# Altium schematic sheet Sche_Voltage regulator.SchDoc
size A
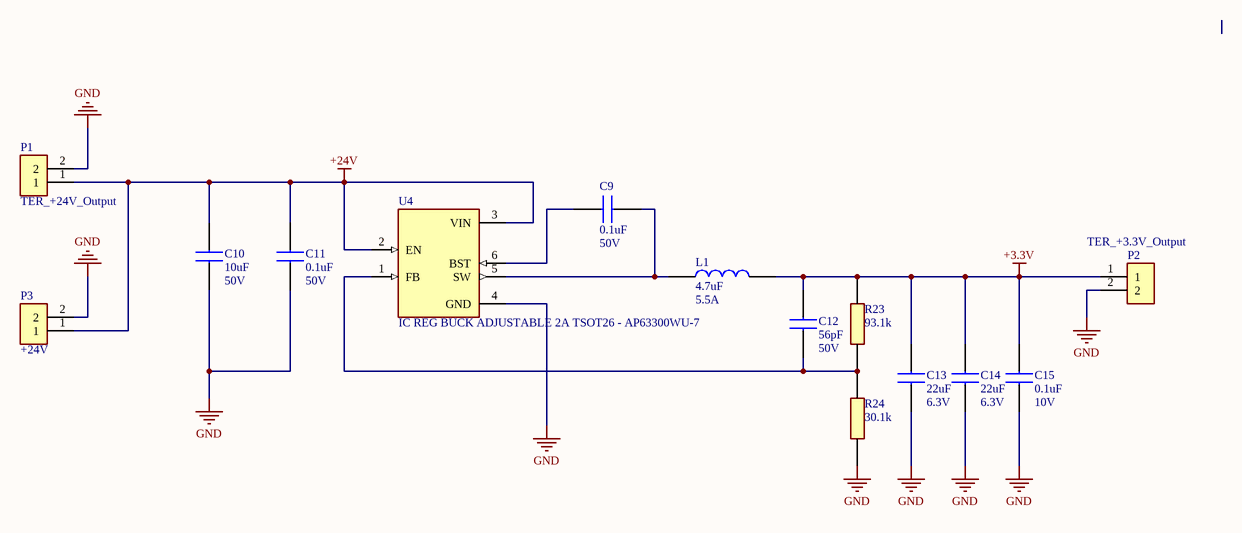
[diagram p0: Sche_Voltage regulator.SchDoc]

## Parts
C9  0.1uF  [C 0603]
C10  10uF  [CAPC3225X290N]
C11  0.1uF  [C 0603]
C12  56pF  [CAPC1005X55N]
C13  22uF  [C 0603]
C14  22uF  [C 0603]
C15  0.1uF  [CAPC1608X95N]
L1  4.7uF  [INDM6965X300N]
P1  Comment_1: TER_+24V_Output  [TE_282837-2]  (hidden comment: TERM BLK 2P SIDE ENT 5.08MM PCB - 282837-2)
P2  Comment_1: TER_+3.3V_Output  [TE_282837-2]  (hidden comment: 282837-2)
P3  Comment_1: +24V  [TE_282837-2]  (hidden comment: 282837-2)
R23  93.1k  [RESC1005X40N]
R24  30.1k  [ERJ2RKD1004X]
U4  IC REG BUCK ADJUSTABLE 2A TSOT26 - AP63300WU-7  [SOT95P280X100-6N]

## Nets
+3.3V: C12.2 C13.2 C14.2 C15.2 L1.2 P2.1 R23.2
+24V: C10.2 C11.2 P1.1 P3.1 U4.2(EN) U4.3(VIN)
GND: C10.1 C11.1 C13.1 C14.1 C15.1 P1.2 P2.2 P3.2 R24.1 U4.4(GND)
NetC9_1: C9.1 U4.6(BST)
NetC9_2: C9.2 L1.1 U4.5(SW)
NetC12_1: C12.1 R23.1 R24.2 U4.1(FB)

## Notes on the sheet
- (in symbol CAP CER 0.1UF 10V X7R 0603 - C0603C104K8RACTU) 10V
- (in symbol CAP CER 0.1UF 50V X7R 0603 - ESD35C104K4T2A-24) 50V
- (in symbol CAP CER 10UF 50V Y5V 1210 - 12105G106ZAT2A) 50V
- (in symbol CAP CER 22UF 6.3V X5R 0603 - GRM188R60J226MEA0D) 6.3V
- (in symbol CAP CER 56PF 50V C0G/NPO 0402 - CC0402JRNPO9BN560) 50V
- (in symbol IND 4.7UH 5.5A 40 MOHM SMD - IHLP2525CZER4R7M01) 5.5A

## Library data of the parts
C9 C11 = CAP CER 0.1UF 50V X7R 0603 - ESD35C104K4T2A-24: CAP CER 0.1UF 50V X7R 0603; Catalog: ESD35C104K4T2A-24
C10 = CAP CER 10UF 50V Y5V 1210 - 12105G106ZAT2A: CAP CER 10UF 50V Y5V 1210; Manufacturer_Name: AVX; Manufacturer_Part_Number: 12105G106ZAT2A/500; Geometry.Height: 2.9mm; Mouser Part Number: *; Mouser Price/Stock: *; Arrow Part Number: *; Arrow Price/Stock: *; Datasheet Link: http://datasheets.avx.com/Y5V.pdf
C12 = CAP CER 56PF 50V C0G/NPO 0402 - CC0402JRNPO9BN560: CAP CER 56PF 50V C0G/NPO 0402; Manufacturer_Name: KEMET; Geometry.Height: 0.55mm; Manufacturer_Part_Number: CC0402JRNPO9BN560; Mouser Part Number: *; Mouser Price/Stock: *; Arrow Part Number: CC0402JRNPO9BN560; Arrow Price/Stock: https://www.arrow.com/en/products/cc0402jrnpo9bn560/yageo; Datasheet Link: https://www.yageo.com/upload/media/product/productsearch/datasheet/mlcc/UPY-GP_NP0_16V-to-50V_18.pdf
C13 C14 = CAP CER 22UF 6.3V X5R 0603 - GRM188R60J226MEA0D: CAP CER 22UF 6.3V X5R 0603; Catalog: GRM188R60J226MEA0D
C15 = CAP CER 0.1UF 10V X7R 0603 - C0603C104K8RACTU: Multilayer Ceramic Capacitors MLCC - SMD/SMT; Manufacturer_Name: KEMET; Manufacturer_Part_Number: C0603C104K8RACTU/1K; Geometry.Height: 0.95mm; Mouser Part Number: N/A; Mouser Price/Stock: https://www.mouser.com/Search/Refine.aspx?Keyword=N%2FA; Arrow Part Number: *; Arrow Price/Stock: *; Datasheet Link: https://api.kemet.com/component-edge/download/specsheet/C0603C104K8RACTU.pdf
L1 = IND 4.7UH 5.5A 40 MOHM SMD - IHLP2525CZER4R7M01: FIXED IND 4.7UH 5.5A 40 MOHM SMD; Manufacturer_Name: Vishay; Geometry.Height: 3mm; Manufacturer_Part_Number: IHLP2525CZER4R7M01; Mouser Part Number: 70-IHLP2525CZER4R7M1; Mouser Price/Stock: https://www.mouser.co.uk/ProductDetail/Vishay-Dale/IHLP2525CZER4R7M01?qs=delkvkPykKkoRC4%2FTC3qyQ%3D%3D; Arrow Part Number: IHLP2525CZER4R7M01; Arrow Price/Stock: https://www.arrow.com/en/products/ihlp2525czer4r7m01/vishay?region=europe; Datasheet Link: https://componentsearchengine.com/Datasheets/2/IHLP2525CZER4R7M01.pdf
P1 = TERM BLK 2P SIDE ENT 5.08MM PCB - 282837-2: TERM BLK 2P SIDE ENT 5.08MM PCB; MF: TE Connectivity; Check_prices: https://www.snapeda.com/parts/282837-2/TE+Connectivity+AMP+Connectors/view-part/?ref=eda; Value: *; Availability: In Stock; MP: 282837-2; Price: None; Package: None; SnapEDA_Link: https://www.snapeda.com/parts/282837-2/TE+Connectivity+AMP+Connectors/view-part/?ref=snap; Purchase-URL: https://pricing.snapeda.com/search/part/282837-2/?ref=eda
P2 P3 = 282837-2: Connector Terminal Blocks Receptacle 2 Position 5.08mm Solder Straight Thru-Hole 13.5A/Contact; MF: TE Connectivity; Check_prices: https://www.snapeda.com/parts/282837-2/TE+Connectivity+AMP+Connectors/view-part/?ref=eda; Value: *; Availability: In Stock; MP: 282837-2; Price: None; Package: None; SnapEDA_Link: https://www.snapeda.com/parts/282837-2/TE+Connectivity+AMP+Connectors/view-part/?ref=snap; Purchase-URL: https://pricing.snapeda.com/search/part/282837-2/?ref=eda
R23 = RES 93.1K OHM 1% 1/16W 0402 - RC0402FR-0793K1L: RES 93.1K OHM 1% 1/16W 0402; Manufacturer_Name: KEMET; Geometry.Height: 0.4mm; Manufacturer_Part_Number: RC0402FR-0793K1L; Mouser Part Number: 603-RC0402FR-0793K1L; Mouser Price/Stock: *; Arrow Part Number: *; Arrow Price/Stock: *; Datasheet Link: http://www.yageo.com/documents/recent/PYu-RC0402_51_RoHS_L_6_r.pdf
R24 = RES SMD 30.1K OHM 1% 1/10W 0402 - ERJ-2RKF3012X: RES SMD 30.1K OHM 1% 1/10W 0402; Manufacturer_Name: Panasonic; Geometry.Height: 0.4mm; Manufacturer_Part_Number: ERJ-2RKF3012X; Mouser Part Number: 667-ERJ-2RKF3012X; Mouser Price/Stock: https://www.mouser.co.uk/ProductDetail/Panasonic/ERJ-2RKF3012X?qs=YMBIwoNQYdWdJYigM0pxkw%3D%3D; Arrow Part Number: *; Arrow Price/Stock: *; Datasheet Link: https://industrial.panasonic.com/cdbs/www-data/pdf/RDA0000/AOA0000C86.pdf
U4 = IC REG BUCK ADJUSTABLE 2A TSOT26 - AP63300WU-7: IC REG BUCK ADJUSTABLE 2A TSOT26; MF: Diodes Incorporated; SnapEDA_Link: https://www.snapeda.com/parts/AP63300WU-7/Diodes%20Inc./view-part/4221814/?ref=snap; Availability: Unavailable; MP: AP63300WU-7; DigiKey-Purchase-URL: https://snapeda.com/shop?store=DigiKey&id=4221814; Price: None; Value: *; Package: SOT-23-6 Diodes Incorporated